# EAGLE design mainboard (EAGLE 8.2.0)
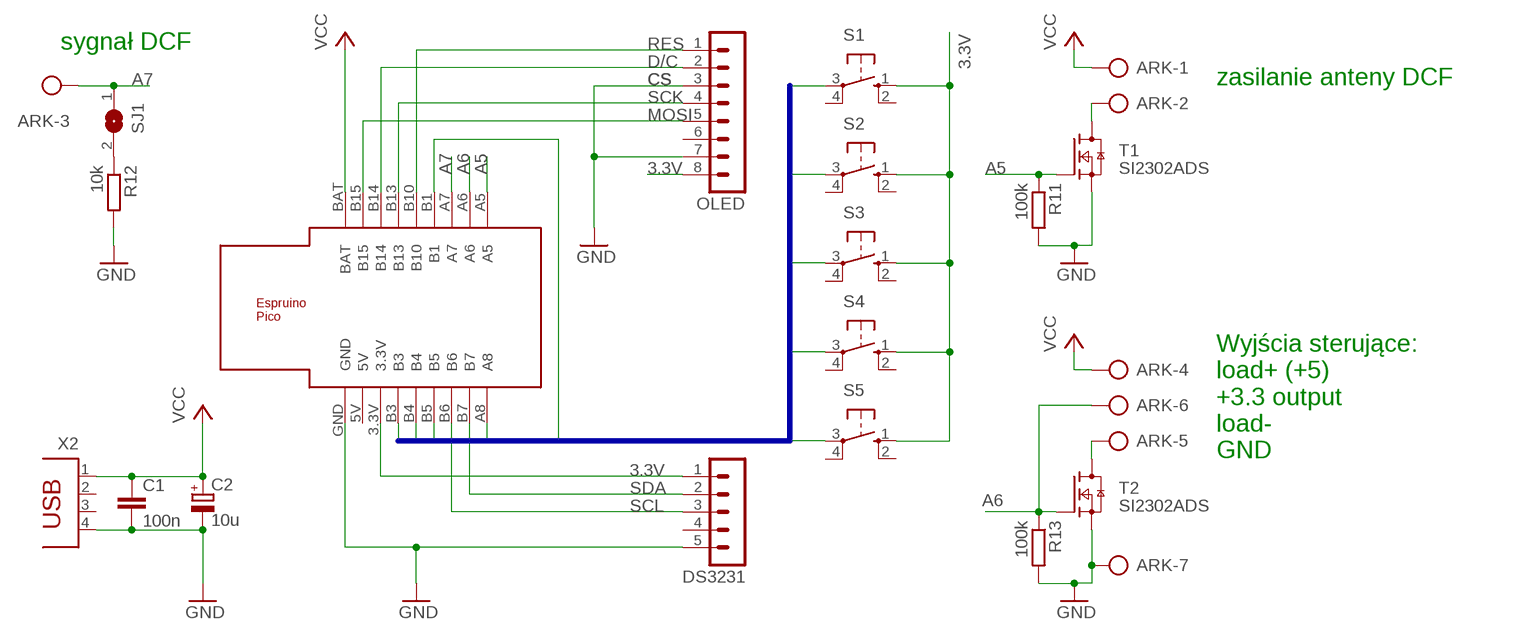
[diagram p0: schematic, sheet 1]

## Parts
ARK  AK500/7  [AK500/7]
C1  100n  C-EUC1206K  [C1206K]
C2  10u  CPOL-EUA/3216-18W  [A/3216-18W]
DS3231  MA05-1  [MA05-1]
OLED  MA08-1  [MA08-1]
R11  100k  R-EU_M0805  [M0805]
R12  10k  R-EU_M0805  [M0805]
R13  100k  R-EU_M0805  [M0805]
S1  10-XX  [B3F-10XX]
S2  10-XX  [B3F-10XX]
S3  10-XX  [B3F-10XX]
S4  10-XX  [B3F-10XX]
S5  10-XX  [B3F-10XX]
SJ1  SJ  [SJ]
T1  SI2302ADS  2N7002E  [SOT23]
T2  SI2302ADS  2N7002E  [SOT23]
U$1  ESPRUINO_PICO_0.1  [ESPRUINO_PICO_0.1]
X2  PN61729  [PN61729]

## Nets
3.3V: DS3231.1 OLED.8 S1.1(S) S2.1(S) S3.1(S) S4.1(S) S5.1(S) U$1.3.3V
A5: R11.1 T1.1(G) U$1.A5
A6: ARK.6 R13.1 T2.1(G) U$1.A6
A7: ARK.3 SJ1.1 U$1.A7
CS: ARK.7 C1.2 C2.- DS3231.5 OLED.3 OLED.7 R11.2 R12.2 R13.2 T1.2(S) T2.2(S) U$1.GND X2.4 ; supply symbol labelled GND
D/C: OLED.2 U$1.B14
MOSI: OLED.5 U$1.B15
N$6: R12.1 SJ1.2
N$7: ARK.2 T1.3(D)
N$10: ARK.5 T2.3(D)
RES: OLED.1 U$1.B10
S1: S1.3(P) U$1.B3
S2: S2.3(P) U$1.B4
S3: S5.3(P) U$1.B5
S4: S4.3(P) U$1.A8
S5: S3.3(P) U$1.B1
SCK: OLED.4 U$1.B13
SCL: DS3231.3 U$1.B6
SDA: DS3231.2 U$1.B7
VCC: ARK.1 ARK.4 C1.1 C2.+ U$1.BAT X2.1
Unconnected: DS3231.4 OLED.6 S1.2(S1) S1.4(P1) S2.2(S1) S2.4(P1) S3.2(S1) S3.4(P1) S4.2(S1) S4.4(P1) S5.2(S1) S5.4(P1) U$1.5V X2.2 X2.3

## Buses
S[1..5]

## Notes on the sheet
- sygnał DCF
- zasilanie anteny DCF
- Wyjścia sterujące:
  load+ (+5)
  +3.3 output
  load-
  GND

## Library data of the parts
ARK = con-ptr500:AK500/7: CONNECTOR; OC_FARNELL: unknown; OC_NEWARK: unknown
C1 = resistor:C-EU: CAPACITOR, European symbol
C2 = resistor:CPOL-EU: POLARIZED CAPACITOR, European symbol
DS3231 = con-lstb:MA05-1: PIN HEADER; OC_FARNELL: unknown; OC_NEWARK: unknown
OLED = con-lstb:MA08-1: PIN HEADER; OC_FARNELL: unknown; OC_NEWARK: unknown
R11-R13 = rcl:R-EU_: RESISTOR, European symbol
S1-S5 = switch-omron:10-XX: OMRON SWITCH; MPN: B3F-1000; OC_FARNELL: 176432; OC_NEWARK: 36M3542
SJ1 = jumper:SJ: SMD solder JUMPER
T1 T2 = NXP_60_26022015:2N7002: N-channel TrenchMOS FET N-channel enhancement mode Field-Effect Transistor (FET) in a plastic package using TrenchMOS technology. AAL Eindhoven MK
U$1 = espruino_pico.lbr:ESPRUINO_PICO_0.1
X2 = con-berg:PN61729: BERG USB connector; OC_FARNELL: unknown; OC_NEWARK: unknown

## Board
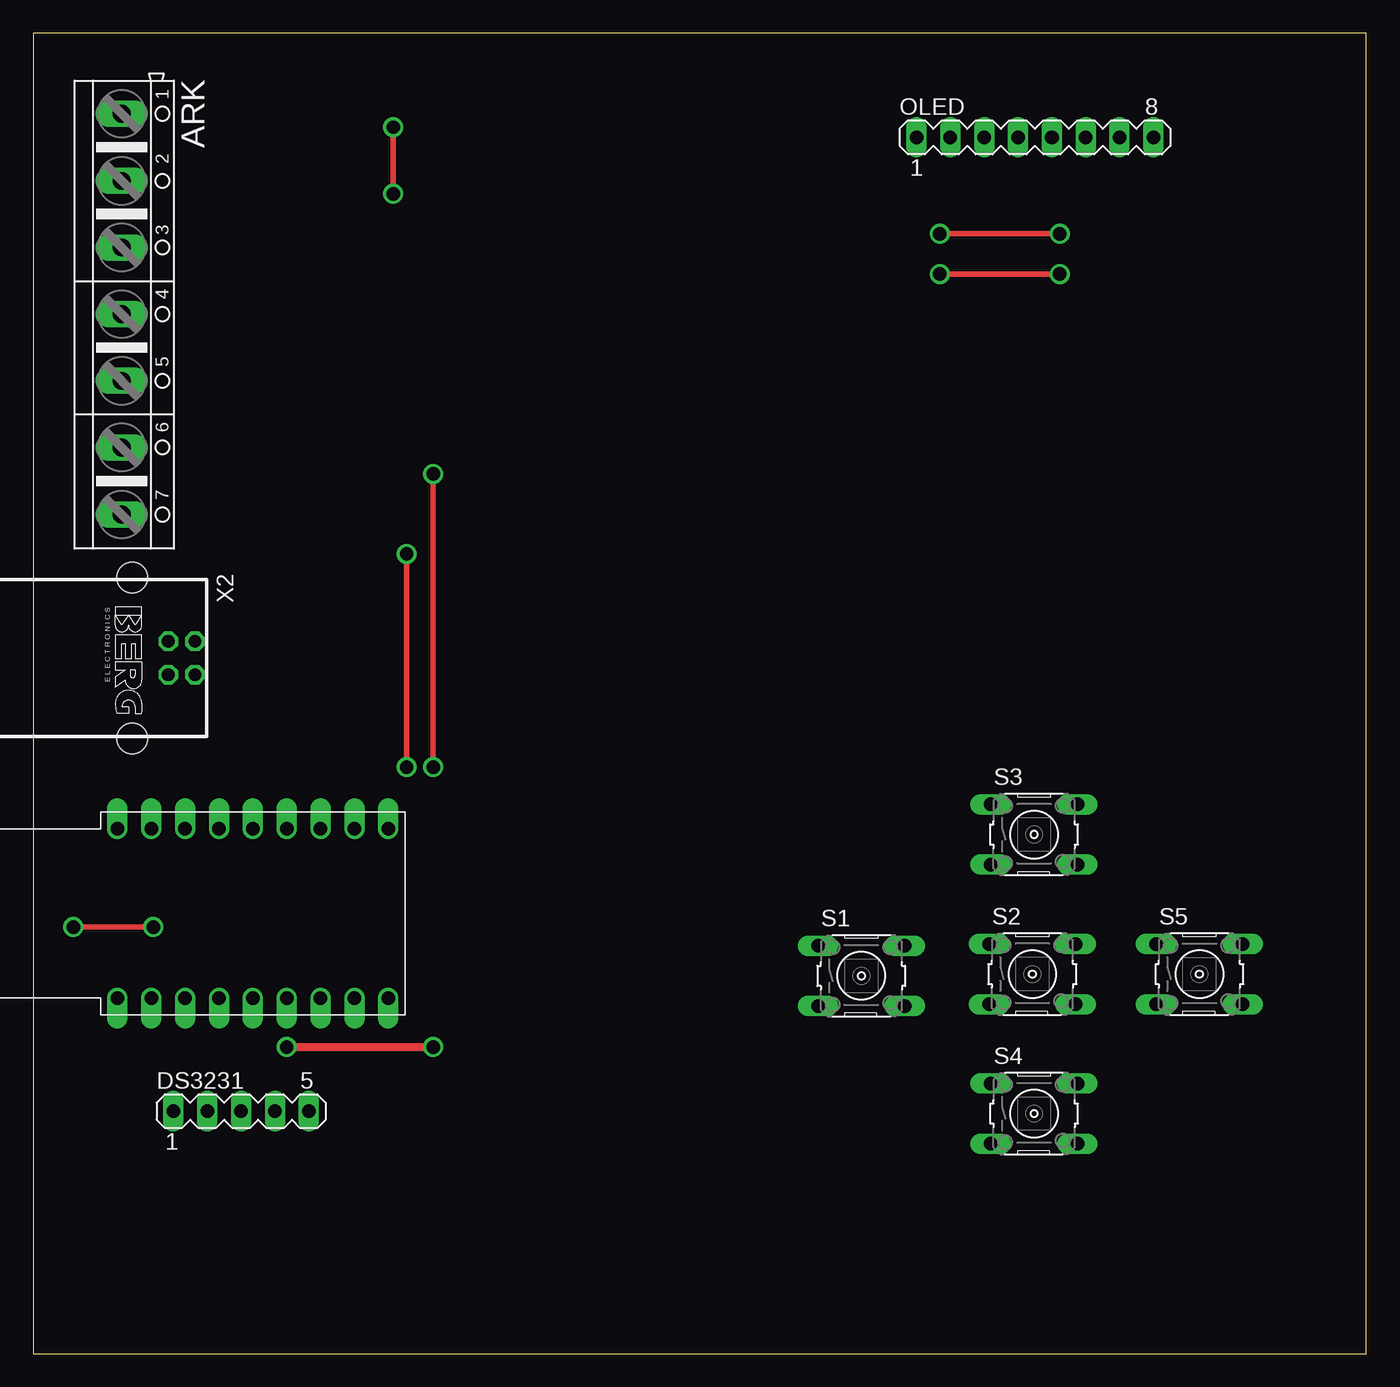
[diagram p1: board, top side]
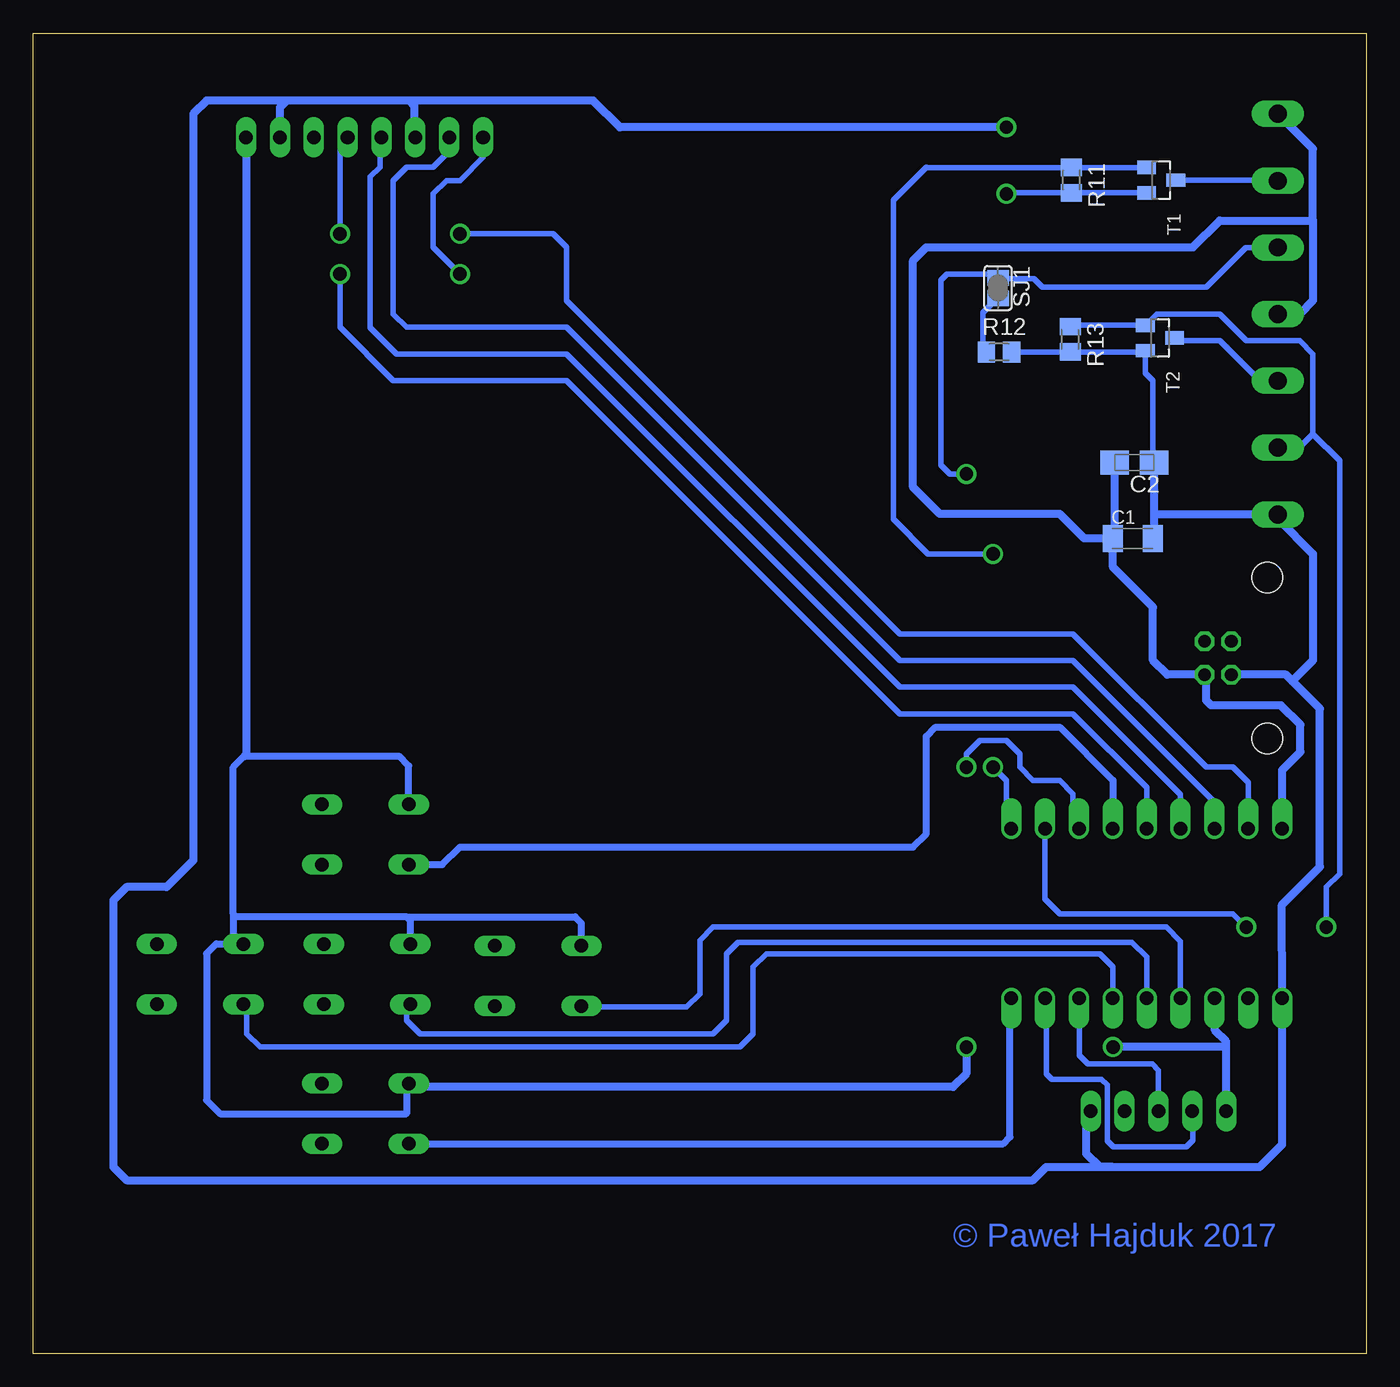
[diagram p2: board, bottom side, seen from below]

Size 100 x 99.05 mm. Coordinates in mm from the lower left corner, seen from the top.
Outline: 0,0 100,0 100,99.05 0,99.05 0,0
Copper layers (1*16): Top 0.035mm / dielectric 1.5mm / Bottom 0.035mm
Design rules "default": minimum track width 6mil, minimum drill 0.35mm, track to track 6mil, track to pad 6mil, pad to pad 6mil, via to via 6mil, smd to smd 6mil, copper to edge 40mil, drill to drill 6mil, minimum pad ring 10mil, minimum via ring 8mil, stop-mask expansion 4mil, vias tented up to drill 0mil, thermal gap 10mil

### Footprints (pad centres in the part's own frame; a part is rotated, then mirrored left to right if it is on the bottom)
AK500/7 = drill 1.321 long: 1 -15.037,0; 2 -10.008,0; 3 -5.004,0; 4 0,0; 5 5.004,0; 6 10.008,0; 7 15.037,0
C1206K = smd 1.5 x 2: 1 -1.5,0; 2 1.5,0
A/3216-18W = smd 2.15 x 1.8: + 1.475,0; - -1.475,0
MA05-1 = drill 1.016 long: 1 -5.08,0; 2 -2.54,0; 3 0,0; 4 2.54,0; 5 5.08,0
MA08-1 = drill 1.016 long: 1 -8.89,0; 2 -6.35,0; 3 -3.81,0; 4 -1.27,0; 5 1.27,0; 6 3.81,0; 7 6.35,0; 8 8.89,0
M0805 = smd 1.3 x 1.6: 1 -0.95,0; 2 0.95,0
B3F-10XX = drill 1.016 long: 1 -3.251,2.261; 2 3.251,2.261; 3 -3.251,-2.261; 4 3.251,-2.261
SJ = smd 1.168 x 1.6: 1 -0.762,0; 2 0.762,0
SOT23 = smd 1 x 1.4: 1 -0.95,-1.1; 2 0.95,-1.1; 3 0,1.1
ESPRUINO_PICO_0.1 = drill 1.016 offset: 3.3V -7.62,-6.35; 5V -10.16,-6.35; A5 7.62,6.35; A6 5.08,6.35; A7 2.54,6.35; A8 7.62,-6.35; B1 0,6.35; B3 -5.08,-6.35; B4 -2.54,-6.35; B5 0,-6.35; B6 2.54,-6.35; B7 5.08,-6.35; B10 -2.54,6.35; B13 -5.08,6.35; B14 -7.62,6.35; B15 -10.16,6.35; BAT -12.7,6.35; GND -12.7,-6.35
PN61729 = drill 0.95 octagon: 1 1.25,4.71; 2 -1.25,4.71; 3 -1.25,2.71; 4 1.25,2.71 | hole 2.3: -6.02,0; 6.02,0

### Placement (x,y rotation side)
ARK  6.63,77.98 270 top
C1  17.52,61.15 0 bottom
C2  17.4,66.85 180 bottom
DS3231  15.59,18.18 0 top
OLED  75.15,91.25 0 top
R11  22.12,88.04 270 bottom
R12  27.54,75.13 0 bottom
R13  22.2,76.09 270 bottom
S1  62.12,28.33 0 top
S2  74.96,28.47 0 top
S3  75.08,38.94 0 top
S4  75.08,18 0 top
S5  87.49,28.46 0 top
SJ1  27.62,79.94 270 bottom
T1  15.38,88.03 270 bottom
T2  15.47,76.2 270 bottom
U$1  19.01,33.02 0 top
X2  7.41,52.18 270 top

### Tracks (layer width: path | path; a pad name or v marks a point on that pad's centre or on a via)
3.3V  (via drill 1)
  Top 0.61: v19,23 v30,23
  Bottom 0.508: S3.1 71.83,44.1 72.56,44.83 84.17,44.83 85,44 85,33 | 85,33 85,31.48 S5.1 84.25,30.73 86.28,30.73 87,30.01 87,19 86,18 72,18 72,20.09 S4.1 | S1.1 58.87,32.28 59.36,32.77 72,32.77 | 72,32.77 84.77,32.77 85,33 | S2.1 71.7,32.47 72,32.77
  Bottom 0.61: DS3231.1 10.51,23 | 10.51,23 10.51,23.42 11.35,24.26 11.35,26.63 U$1.3.3V | v30,23 30,21 31,20 71.91,20 72,20.09 | 10.51,23 v19,23 | OLED.8 84.04,44.96 84.17,44.83
A5  (via drill 1)
  Top 0.406: v28,44 v28,60
  Bottom 0.406: 22.13,89 R11.1 | T1.1 R11.1 | v28,60 32.87,60 35.48,62.61 35.48,86.52 33,89 32.99,88.99 R11.1 | v28,44 27,43 27,39.74 U$1.A5
A6  (via drill 1)
  Top 0.406: v9,32 v3,32
  Bottom 0.406: ARK.6 5.03,67.97 4,69 | 4,69 4,75 5,76 9,76 11,78 15.72,78 T2.1 22.09,77.15 R13.1 | U$1.A6 24.09,34.09 23,33 10,33 v9,32 | v3,32 3,35 2,36 2,67 4,69
A7  (via drill 1)
  Top 0.406: v30,44 v30,66
  Bottom 0.406: ARK.3 9.02,82.98 12,80 24.29,80 24.94,80.64 27.56,80.64 SJ1.1 27.92,81 31.44,81 31.92,80.52 31.92,66.67 31.25,66 v30,66 | v30,44 30,45 29,46 27,46 26,45 26,44 25,43 23,43 22,42 22,39.82 U$1.A7
CS  (via drill 1)
  Top 0.406: v27,87 v27,92
  Bottom 0.406: C2.- 16,66.92 16,73 16.57,73.57 T2.2 16.68,75.14 R13.2 R12.2 | T1.2 R11.2 26.91,87.09 v27,87
  Bottom 0.61: C1.2 15.93,61.24 15.93,63 | C2.- 15.93,63 | DS3231.5 21,17.85 21,15 20,14 19,14 | 19,14 8,14 6.31,15.69 U$1.GND 6.33,33.67 3.48,36.52 3.48,48.39 5.54,50.46 | OLED.7 81.5,93.5 81,94 | 71.82,94 81,94 | 71.82,94 71.42,93.6 71.42,91.33 OLED.3 | 5.54,50.46 6.02,50.93 X2.4 | 5.54,50.46 4,52 4,60 6.63,62.63 ARK.7 15.87,62.94 15.93,63 | 81,94 87,94 88,93 88,37 90,35 93,35 94,34 94,14 93,13 25,13 24,14 19,14 | v27,92 56,92 58,94 71.82,94
D/C
  Bottom 0.406: OLED.2 69,91.05 69,90 70,89 72,89 73,88 73,78 72,77 60,77 35,52 22,52 11.39,41.39 U$1.B14
MOSI  (via drill 1)
  Top 0.406: v68,84 v77,84
  Bottom 0.406: U$1.B15 8.85,42.85 10,44 12,44 22,54 35,54 60,79 60,83 61,84 v68,84 | v77,84 77,90.67 OLED.5
N$6
  Bottom 0.406: SJ1.2 27.68,79.18 28.75,78.11 28.75,75.39 R12.1
N$7
  Bottom 0.406: T1.3 6.67,88.03 ARK.2
N$10
  Bottom 0.406: ARK.5 7.98,72.98 11,76 14.17,76 T2.3
RES  (via drill 1)
  Top 0.406: v68,81 v77,81
  Bottom 0.406: OLED.1 66.26,89.74 68,88 69,88 70,87 70,83 v68,81 | v77,81 77,77 73,73 60,73 35,48 22,48 16.47,42.47 U$1.B10
S1
  Bottom 0.406: U$1.B3 13.93,30.93 15,32 49,32 50,31 50,27 51,26 58.8,26 59,26.2 S1.3
S2
  Bottom 0.406: U$1.B4 16.47,29.76 17.57,30.86 47.14,30.86 48,30 48,25 49,24 71,24 72,25 72,25.91 S2.3
S3
  Bottom 0.406: U$1.B5 19.01,29.01 20,30 45,30 46,29 46,24 47,23 83,23 84,24 84,25.96 S5.3
S4
  Bottom 0.508: U$1.A8 26.72,26.58 26.72,16.26 27.23,15.74 S4.3
S5
  Bottom 0.508: S3.3 69.32,36.68 68,38 34,38 33,39 33,46.3 32.3,46.99 22.99,46.99 19,43 U$1.B1
SCK
  Bottom 0.406: 13.93,40.93 U$1.B13 13.93,41.93 22,50 35,50 60,75 72.76,75 74.72,76.96 74.72,88.28 74,89 74,91.13 OLED.4
SCL
  Bottom 0.406: DS3231.3 15.59,21.26 16.05,21.72 20.88,21.72 21.51,22.35 21.51,26.63 U$1.B6
SDA
  Bottom 0.406: DS3231.2 13,18.13 13,16 13.51,15.49 18.97,15.49 19.43,15.95 19.43,20.14 19.86,20.57 23.57,20.57 24,21 24,26.58 U$1.B7
VCC
  Bottom 0.61: C1.1 18.88,61.3 C2.+ | ARK.1 4,90.39 4,85 | 4,85 4,79 5,78 6,78 6.02,77.98 ARK.4 | 6,39.68 U$1.BAT 6.31,43.77 4.94,45.14 4.94,47.18 6.39,48.63 11.63,48.63 12,49 12,50.81 X2.1 14.93,50.93 16,52 16,56 19,59 19,61.13 C1.1 | C1.1 21.15,61.15 23,63 32,63 34,65 34,82 33,83 13,83 11,85 4,85

### Text on the board
Bottom: © Paweł Hajduk 2017
Document: DCF+ / DCF- / DCF S | LOAD+ / LOAD- / 3.3 OUT / GND | + D C N -